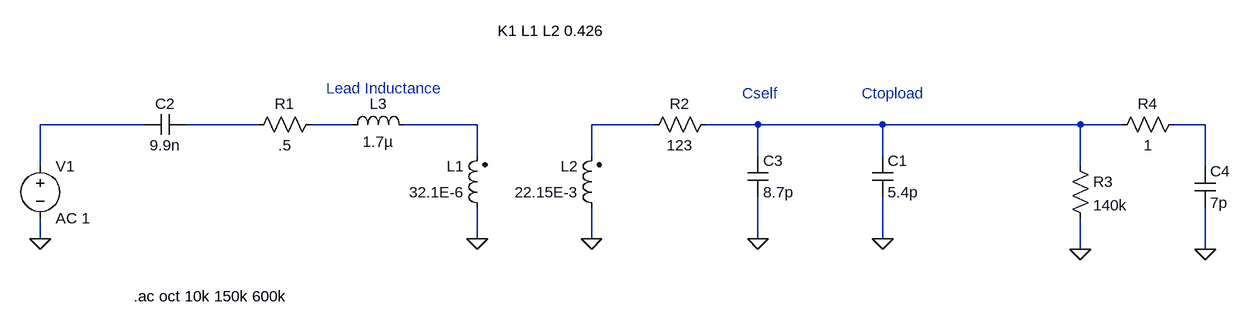
[diagram p0: schematic tesla_coil_freq_fit_v2.asc]
tesla_coil_freq_fit_v2.asc, the LTspice schematic file:
Version 4
SHEET 1 1340 680
WIRE -352 96 -512 96
WIRE -176 96 -288 96
WIRE -32 96 -96 96
WIRE 160 96 48 96
WIRE 432 96 336 96
WIRE 592 96 512 96
WIRE 784 96 592 96
WIRE 1088 96 784 96
WIRE 1152 96 1088 96
WIRE 1280 96 1232 96
WIRE 160 144 160 96
WIRE 336 144 336 96
WIRE 592 144 592 96
WIRE 784 144 784 96
WIRE -512 160 -512 96
WIRE 1088 160 1088 96
WIRE 1280 160 1280 96
WIRE -512 272 -512 240
WIRE 160 272 160 224
WIRE 336 272 336 224
WIRE 592 272 592 208
WIRE 784 272 784 208
WIRE 1088 288 1088 240
WIRE 1280 288 1280 224
FLAG 784 272 0
FLAG 160 272 0
FLAG -512 272 0
FLAG 1088 288 0
FLAG 592 272 0
FLAG 336 272 0
FLAG 1280 288 0
SYMBOL ind2 176 240 R180
WINDOW 0 36 80 Left 2
WINDOW 3 36 40 Left 2
SYMATTR InstName L1
SYMATTR Value 32.1E-6
SYMATTR Type ind
SYMBOL ind2 352 240 R180
WINDOW 0 36 80 Left 2
WINDOW 3 36 40 Left 2
SYMATTR InstName L2
SYMATTR Value 22.15E-3
SYMATTR Type ind
SYMBOL res -80 80 R90
WINDOW 0 0 56 VBottom 2
WINDOW 3 32 56 VTop 2
SYMATTR InstName R1
SYMATTR Value .5
SYMBOL res 528 80 R90
WINDOW 0 0 56 VBottom 2
WINDOW 3 32 56 VTop 2
SYMATTR InstName R2
SYMATTR Value 123
SYMBOL cap -288 80 R90
WINDOW 0 0 32 VBottom 2
WINDOW 3 32 32 VTop 2
SYMATTR InstName C2
SYMATTR Value 9.9n
SYMBOL cap 768 144 R0
SYMATTR InstName C1
SYMATTR Value 5.4p
SYMBOL voltage -512 144 R0
SYMATTR InstName V1
SYMATTR Value AC 1
SYMBOL res 1072 144 R0
SYMATTR InstName R3
SYMATTR Value 140k
SYMBOL ind -48 112 R270
WINDOW 0 32 56 VTop 2
WINDOW 3 5 56 VBottom 2
SYMATTR InstName L3
SYMATTR Value 1.7µ
SYMBOL cap 576 144 R0
SYMATTR InstName C3
SYMATTR Value 8.7p
SYMBOL cap 1264 160 R0
SYMATTR InstName C4
SYMATTR Value 7p
SYMBOL res 1248 80 R90
WINDOW 0 0 56 VBottom 2
WINDOW 3 32 56 VTop 2
SYMATTR InstName R4
SYMATTR Value 1
TEXT 192 -48 Left 2 !K1 L1 L2 0.426
TEXT -368 360 Left 2 !.ac oct 10k 150k 600k
TEXT 568 48 Left 2 ;Cself
TEXT 752 48 Left 2 ;Ctopload
TEXT -72 40 Left 2 ;Lead Inductance

The netlist it stands for:
* tesla_coil_freq_fit_v2.asc
L1 0 N004 32.1E-6
L2 0 N005 22.15E-3
R1 N003 N002 .5
R2 N006 N005 123
C2 N002 N001 9.9n
C1 N006 0 5.4p
V1 N001 0 AC 1
R3 N006 0 140k
L3 N003 N004 1.7µ
C3 N006 0 8.7p
C4 N007 0 7p
R4 N007 N006 1
K1 L1 L2 0.426
.ac oct 10k 150k 600k
* Cself
* Ctopload
* Lead Inductance
.backanno
.end